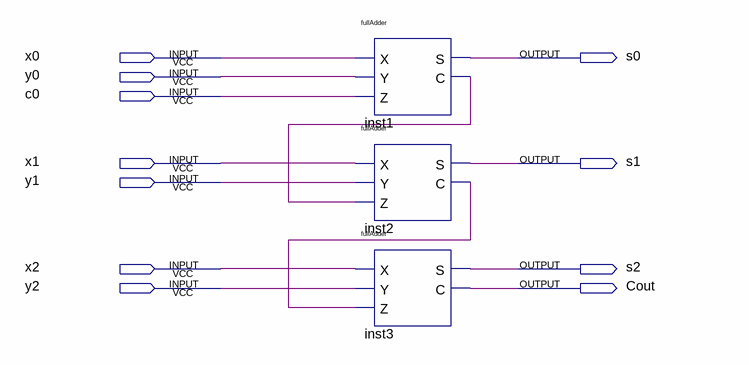
[diagram p0: schematic sheet]
// Quartus schematic trippleAdder.bdf as structural Verilog: 3 symbols, 11 pins
module trippleAdder (
  input  x0,
  input  y0,
  input  c0,
  input  x1,
  input  y1,
  input  x2,
  input  y2,
  output s0,
  output s1,
  output s2,
  output Cout
);

  wire inst1_c, inst2_c;

  fullAdder inst1 (.X(x0), .Y(y0), .Z(c0), .S(s0), .C(inst1_c));
  fullAdder inst2 (.X(x1), .Y(y1), .Z(inst1_c), .S(s1), .C(inst2_c));
  fullAdder inst3 (.X(x2), .Y(y2), .Z(inst2_c), .S(s2), .C(Cout));
endmodule
